# Altium schematic sheet clk_gen.SchDoc: Small Impedance Meter (Clock Generator)
size A4; ApprovedBy: Matej Gomboc; CheckedBy: Matej Gomboc; Author: Matej Gomboc; DrawnBy: Matej Gomboc; Engineer: Matej Gomboc; DocumentNumber: 3; Revision: 1.0; SheetNumber: 3; SheetTotal: 3; DocumentName: Clock Generator; ProjectName: Small Impedance Meter
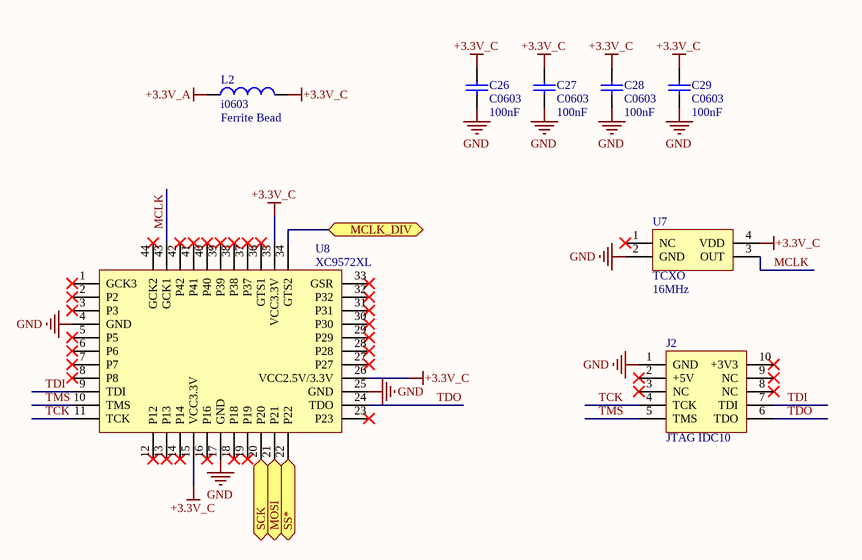
[diagram p0: clk_gen.SchDoc]

## Parts
C26  C0603  value 100nF  [0603_HandSoldering]
C27  C0603  value 100nF  [0603_HandSoldering]
C28  C0603  value 100nF  [0603_HandSoldering]
C29  C0603  value 100nF  [0603_HandSoldering]
J2  JTAG IDC10  [IDC10]
L2  i0603  value Ferrite Bead  [0603_HandSoldering]
U7  TCXO  value 16MHz  [TCXO_5x3]
U8  XC9572XL  [XC9572XL_QFP44]

## Ports
MCLK_DIV, MOSI, SCK, SS*

## Nets
+3.3V_A: L2.1
+3.3V_C: C26.1 C27.1 C28.1 C29.1 L2.2 U7.4(VDD) U8.15(VCC3.3V) U8.26(VCC2.5V/3.3V) U8.35(VCC3.3V)
GND: C26.2 C27.2 C28.2 C29.2 J2.1(GND) U7.2(GND) U8.4(GND) U8.17(GND) U8.25(GND)
MCLK: U7.3(OUT) U8.43(GCK1)
MCLK_DIV: U8.34(GTS2) ; port MCLK_DIV
MOSI: U8.21(P21) ; port MOSI
SCK: U8.20(P20) ; port SCK
SS*: U8.22(P22) ; port SS*
TCK: J2.4(TCK) U8.11(TCK)
TDI: J2.7(TDI) U8.9(TDI)
TDO: J2.6(TDO) U8.24(TDO)
TMS: J2.5(TMS) U8.10(TMS)

Not connected (* = marked no-connect by the designer): J2 2(+5V)* 3(NC)* 8(NC)* 9(NC)* 10(+3V3)*; U7 1(NC)*; U8 1(GCK3)* 2(P2)* 3(P3)* 5(P5)* 6(P6)* 7(P7)* 8(P8)* 12(P12)* 13(P13)* 14(P14)* 16(P16)* 18(P18)* 19(P19)* 23(P23)* 27(P27)* 28(P28)* 29(P29)* 30(P30)* 31(P31)* 32(P32)* 33(GSR)* 36(GTS1)* 37(P37)* 38(P38)* 39(P39)* 40(P40)* 41(P41)* 42(P42)* 44(GCK2)*

## Library data of the parts
C26-C29 = Capacitor: Ceramic Capacitor
J2 = JTAG_IDC10: JTAG IDC10 Bus Pirate Programming Interface
L2 = Inductor
U7 = TCXO: FOX924B-16.000  TCXO, 3.3V CMOS, SMD
U8 = XC9572XL: Xilinx CPLD 72 Macrocells